# Altium project GR_Architecture.PrjPCB
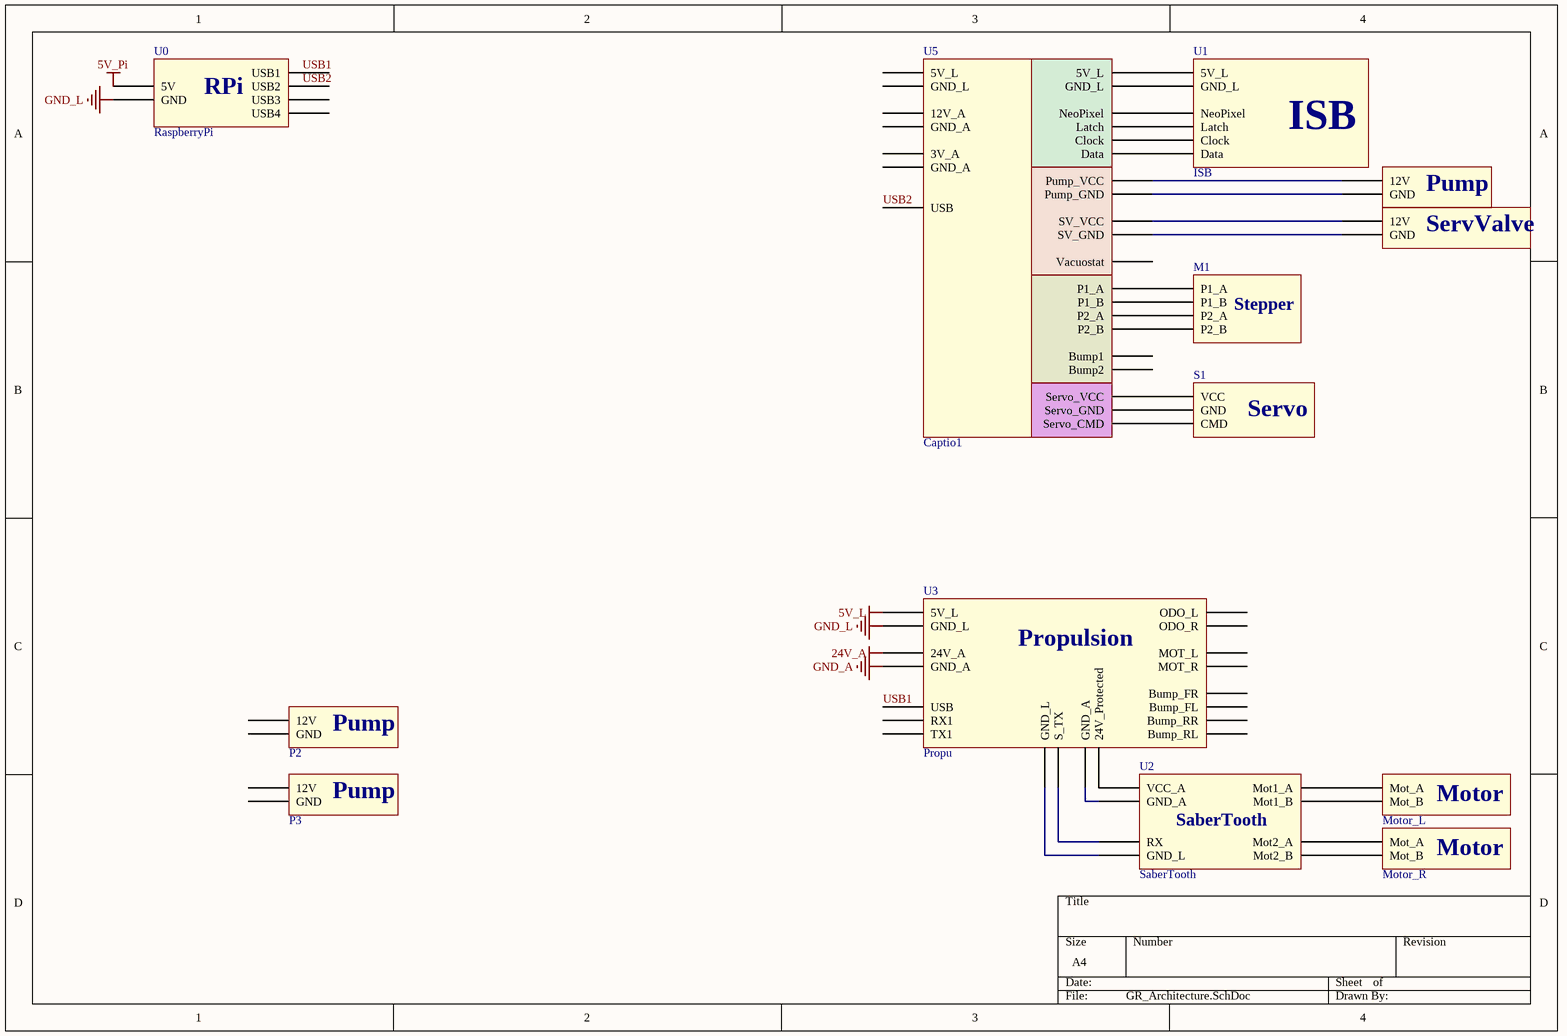
[diagram p0: GR_Architecture.SchDoc]
1 sheet, 13 parts. Net scope: global (net labels, ports and power ports of the same name join across sheets).

## Sheet GR_Architecture.SchDoc
size A4

### Parts
M1  Stepper  (value not drawn)
Motor_L  Motor  (value not drawn)
Motor_R  Motor  (value not drawn)
P1  Pump  (value not drawn)
P2  Pump  (value not drawn)
P3  Pump  (value not drawn)
S1  Servo  (value not drawn)
Se1  ServoValve  (value not drawn)
U0  RaspberryPi
U1  ISB
U2  SaberTooth
U3  Propu
U5  Captio1

### Nets
5V_L: U3.43(5V_L)
5V_Pi: U0.74(5V)
24V_A: U3.45(24V_A)
GND_A: U3.46(GND_A)
GND_L: U0.75(GND) U3.44(GND_L)
USB1: U3.47(USB)
USB2: U5.82(USB)
NetM1_87: M1.87(P1_A) U5.83(P1_A)
NetM1_88: M1.88(P1_B) U5.84(P1_B)
NetM1_89: M1.89(P2_A) U5.85(P2_A)
NetM1_90: M1.90(P2_B) U5.86(P2_B)
NetMotor_L_64: Motor_L.64(Mot_B) U2.71(Mot1_B)
NetMotor_L_65: Motor_L.65(Mot_A) U2.70(Mot1_A)
NetMotor_R_64: Motor_R.64(Mot_B) U2.73(Mot2_B)
NetMotor_R_65: Motor_R.65(Mot_A) U2.72(Mot2_A)
NetP1_41: P1.41(12V) U5.83(Pump_VCC)
NetP1_42: P1.42(GND) U5.84(Pump_GND)
NetS1_91: S1.91(VCC) U5.86(Servo_VCC)
NetS1_92: S1.92(GND) U5.86(Servo_GND)
NetS1_93: S1.93(CMD) U5.86(Servo_CMD)
NetSe1_41: Se1.41(12V) U5.85(SV_VCC)
NetSe1_42: Se1.42(GND) U5.86(SV_GND)
NetU1_35: U1.35(5V_L) U5.35(5V_L)
NetU1_36: U1.36(GND_L) U5.36(GND_L)
NetU1_37: U1.37(NeoPixel) U5.37(NeoPixel)
NetU1_38: U1.38(Latch) U5.38(Latch)
NetU1_39: U1.39(Clock) U5.39(Clock)
NetU1_40: U1.40(Data) U5.40(Data)
NetU2_66: U2.66(VCC_A) U3.49(24V_Protected)
NetU2_67: U2.67(GND_A) U3.50(GND_A)
NetU2_68: U2.68(RX) U3.52(S_TX)
NetU2_69: U2.69(GND_L) U3.53(GND_L)

Not connected (* = marked no-connect by the designer): P2 41(12V) 42(GND); P3 41(12V) 42(GND); U0 76(USB1) 77(USB2) 78(USB3) 79(USB4); U3 54(ODO_L) 55(ODO_R) 56(MOT_L) 57(MOT_R) 58(Bump_FR) 59(Bump_FL) 60(RX1) 61(TX1) 62(Bump_RR) 63(Bump_RL); U5 80(5V_L) 81(GND_L)

### Notes on the sheet
- Labels drawn without touching a wire or pin: USB1, USB2
- (in symbol Propu) Propulsion
- (in symbol RaspberryPi) RPi
- (in symbol ServoValve) ServValve